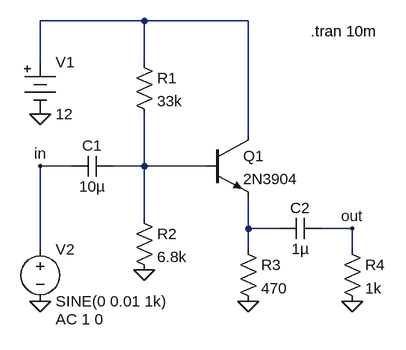
[diagram p0: schematic 5-cc.asc]
5-cc.asc, the LTspice schematic file:
Version 4.1
SHEET 1 880 680
WIRE 80 -64 -80 -64
WIRE 240 -64 80 -64
WIRE -80 0 -80 -64
WIRE 80 0 80 -64
WIRE 240 112 240 -64
WIRE -32 160 -80 160
WIRE 80 160 80 80
WIRE 80 160 32 160
WIRE 176 160 80 160
WIRE 80 240 80 160
WIRE 240 256 240 208
WIRE 288 256 240 256
WIRE 400 256 352 256
WIRE -80 288 -80 160
WIRE 240 288 240 256
WIRE 400 288 400 256
FLAG -80 80 0
FLAG -80 368 0
FLAG 80 320 0
FLAG 240 368 0
FLAG -80 160 in
FLAG 400 368 0
FLAG 400 256 out
SYMBOL npn 176 112 R0
SYMATTR InstName Q1
SYMATTR Value 2N3904
SYMBOL res 64 -16 R0
SYMATTR InstName R1
SYMATTR Value 33k
SYMBOL res 64 224 R0
SYMATTR InstName R2
SYMATTR Value 6.8k
SYMBOL res 224 272 R0
SYMATTR InstName R3
SYMATTR Value 470
SYMBOL Misc\\battery -80 -16 R0
SYMATTR InstName V1
SYMATTR Value 12
SYMBOL voltage -80 272 R0
WINDOW 123 24 124 Left 2
WINDOW 39 0 0 Left 0
SYMATTR Value2 AC 1 0
SYMATTR InstName V2
SYMATTR Value SINE(0 0.01 1k)
SYMBOL cap 352 240 R90
WINDOW 0 0 32 VBottom 2
WINDOW 3 32 32 VTop 2
SYMATTR InstName C2
SYMATTR Value 1µ
SYMBOL cap 32 144 R90
WINDOW 0 0 32 VBottom 2
WINDOW 3 32 32 VTop 2
SYMATTR InstName C1
SYMATTR Value 10µ
SYMBOL res 384 272 R0
SYMATTR InstName R4
SYMATTR Value 1k
TEXT 336 -48 Left 2 !.tran 10m

The netlist it stands for:
* 5-cc.asc
Q1 N001 N002 N003 0 2N3904
R1 N001 N002 33k
R2 N002 0 6.8k
R3 N003 0 470
V1 N001 0 12
V2 in 0 SINE(0 0.01 1k) AC 1 0
C2 out N003 1µ
C1 N002 in 10µ
R4 out 0 1k
.model NPN NPN
.model PNP PNP
.lib standard.bjt
.tran 10m
.backanno
.end